# EAGLE schematic ir remote (EAGLE 6.5.0)
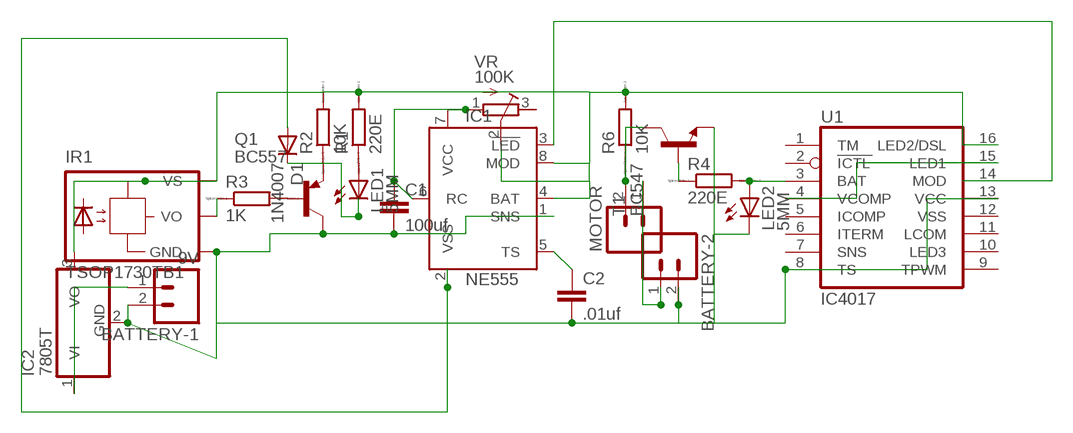
[diagram p0: schematic, sheet 1]

## Parts
BATTERY-1  9V  M02  [02P]
BATTERY-2  M02  [02P]
C1  100uf  C5/7.2  [C5B7.2]
C2  .01uf  C2,5-3  [C2.5-3]
D1  1N4007  1N4004  [DO41-10]
IC1  NE555  BQ2000TPN  [DIL08]
IC2  7805T  [TO220H]
IR1  TSOP1730TB1  [TSOP17_TB1]
LED1  5MM  LED5MM  [LED5MM]
LED2  5MM  LED5MM  [LED5MM]
MOTOR  M02  [02P]
Q1  BC557  [TO92]
R1  220E  R0204/7  [0204/7]
R2  10K  R0204/7  [0204/7]
R3  1K  R0204/7  [0204/7]
R4  220E  R0204/7  [0204/7]
R6  10K  R0204/7  [0204/7]
T1  BC547  [TO92]
U1  IC4017  BQ2054PN  [DIL16]
VR  100K  R-TRIMM64P  [RTRIM64P]

## Nets
N$1: C1.1 IC1.6(RC) IC1.7(VCC) VR.1(E)
N$2: LED2.A R4.2 U1.3(BAT)
N$3: BATTERY-1.2 BATTERY-2.2 C1.2 C2.2 IC1.1(SNS) IC2.2(GND) IR1.GND LED2.K(C) Q1.3(C) T1.1(E) U1.8(TS) U1.13(VCC)
N$4: D1.A IC1.2(VSS)
N$5: IR1.VO R3.1
N$6: Q1.2(B) R3.2
N$7: C2.1 IC1.5(TS)
N$8: U1.4(VCOMP) U1.15(LED1)
N$9: IC1.4(BAT) IC1.8(MOD) IC2.3(VO) IR1.VS R1.2 R2.2 R6.2 U1.16(LED2/DSL) VR.2(S)
N$10: LED1.A R1.1
N$11: D1.C LED1.K(C) Q1.1(E) R2.1
N$12: R4.1 T1.2(B)
N$13: MOTOR.2 R6.1 T1.3(C)
N$14: BATTERY-2.1 MOTOR.1
N$15: IC1.3(!LED) U1.14(MOD)
N$17: BATTERY-1.1 IC2.1(VI)
Unconnected: U1.1(TM) U1.2(ICTL) U1.5(ICOMP) U1.6(ITERM) U1.7(SNS) U1.9(TPWM) U1.10(LED3) U1.11(LCOM) VR.3(A)

## Power pins joined to a net without a drawn wire
VSS: U1.12(VSS)

## Library data of the parts
BATTERY-1 BATTERY-2 MOTOR = con-amp-quick:M02: AMP QUICK CONNECTOR; OC_FARNELL: unknown; OC_NEWARK: unknown
C1 C2 = capacitor-wima:C: CAPACITOR naming: grid - package width
D1 = diode:1N4004: DIODE general purpose rectifier, 1 A
IC1 = texas:BQ2000TPN: CHARGE MANAGEMENT IC; MF: TEXAS INSTRUMENT CONNECTORS; MPN: BQ2000TPN-B5; OC_FARNELL: unknown; OC_NEWARK: 74C7505
IC2 = linear:78*: Positive VOLTAGE REGULATOR Source: http://cache.national.com/ds/LM/LM78L05.pdf http://www.fairchildsemi.com/ds/LM/LM7805.pdf
IR1 = telefunken:TSOP17*TB1: TSOP17..TB1 IR Receiver Modules for Remote Control Systems Source: http://www.vishay.com/docs/82042/82042.pdf; OC_FARNELL: unknown; OC_NEWARK: unknown
LED1 LED2 = led:LED: LED OSRAM: - CHIPLED LG R971, LG N971, LY N971, LG Q971, LY Q971, LO R971, LY R971 LH N974, LH R974 LS Q976, LO Q976, LY Q976 LO Q996 - Hyper CHIPLED LW Q18S LB Q993, LB Q99A, LB R99A - SideLED LS A670, LO A670, LY A670, LG A670, LP A670 LB A673, LV A673, LT A673, LW A673 LH A674 LY A675 LS A676, LA A676, LO A676, LY A676, LW A676 LS A679, LY A679, LG A679 - Hyper Micro SIDELED® LS Y876, LA Y876, LO Y876, LY Y876 LT Y87S - SmartLED LW L88C, LW L88S LB L89C, LB L89S, LG L890 LS L89K, LO L89K, LY L89K LS L896, LA L896, LO L896, LY L896 - TOPLED LS T670, LO T670, LY T670, LG T670, LP T670 LSG T670, LSP T670, LSY T670, LOP T670, LYG T670 LG T671, LOG T671, LSG T671 LB T673, LV T673, LT T673, LW T673 LH T674 LS T676, LA T676, LO T676, LY T676, LB T676, LH T676, LSB T676, LW T676 LB T67C, LV T67C, LT T67C, LS T67K, LO T67K, LY T67K, LW E67C LS E67B, LA E67B, LO E67B, LY E67B, LB E67C, LV E67C, LT E67C LW T67C LS T679, LY T679, LG T679 LS T770, LO T770, LY T770, LG T770, LP T770 LB T773, LV T773, LT T773, LW T773 LH T774 LS E675, LA E675, LY E675, LS T675 LS T776, LA T776, LO T776, LY T776, LB T776 LHGB T686 LT T68C, LB T68C - Hyper Mini TOPLED® LB M676 - Mini TOPLED Santana® LG M470 LS M47K, LO M47K, LY M47K Source: http://www.osram.convergy.de LUXEON: - LUMILED® LXK2-PW12-R00, LXK2-PW12-S00, LXK2-PW14-U00, LXK2-PW14-V00 LXK2-PM12-R00, LXK2-PM12-S00, LXK2-PM14-U00 LXK2-PE12-Q00, LXK2-PE12-R00, LXK2-PE12-S00, LXK2-PE14-T00, LXK2-PE14-U00 LXK2-PB12-K00, LXK2-PB12-L00, LXK2-PB12-M00, LXK2-PB14-N00, LXK2-PB14-P00, LXK2-PB14-Q00 LXK2-PR12-L00, LXK2-PR12-M00, LXK2-PR14-Q00, LXK2-PR14-R00 LXK2-PD12-Q00, LXK2-PD12-R00, LXK2-PD12-S00 LXK2-PH12-R00, LXK2-PH12-S00 LXK2-PL12-P00, LXK2-PL12-Q00, LXK2-PL12-R00 Source: www.luxeon.com KINGBRIGHT: KA-3528ASYC Source: www.kingbright.com
Q1 = transistor-pnp:BC557: PNP Transistor
R1-R4 R6 = eagle-ltspice:R: RESISTOR, European symbol; SPICEMODEL: NONE; SPICEPREFIX: R
T1 = transistor:BC547: NPN TRANSISTOR
U1 = texas:BQ2054PN: CHARGE MANAGEMENT IC; MF: TEXAS INSTRUMENT CONNECTORS; MPN: BQ2054PN; OC_FARNELL: 8407789; OC_NEWARK: 74C7582
VR = resistor:R-TRIMM: Trimm resistor